# Altium schematic sheet control.SchDoc
size A4; SheetNumber: 1; SheetTotal: 2
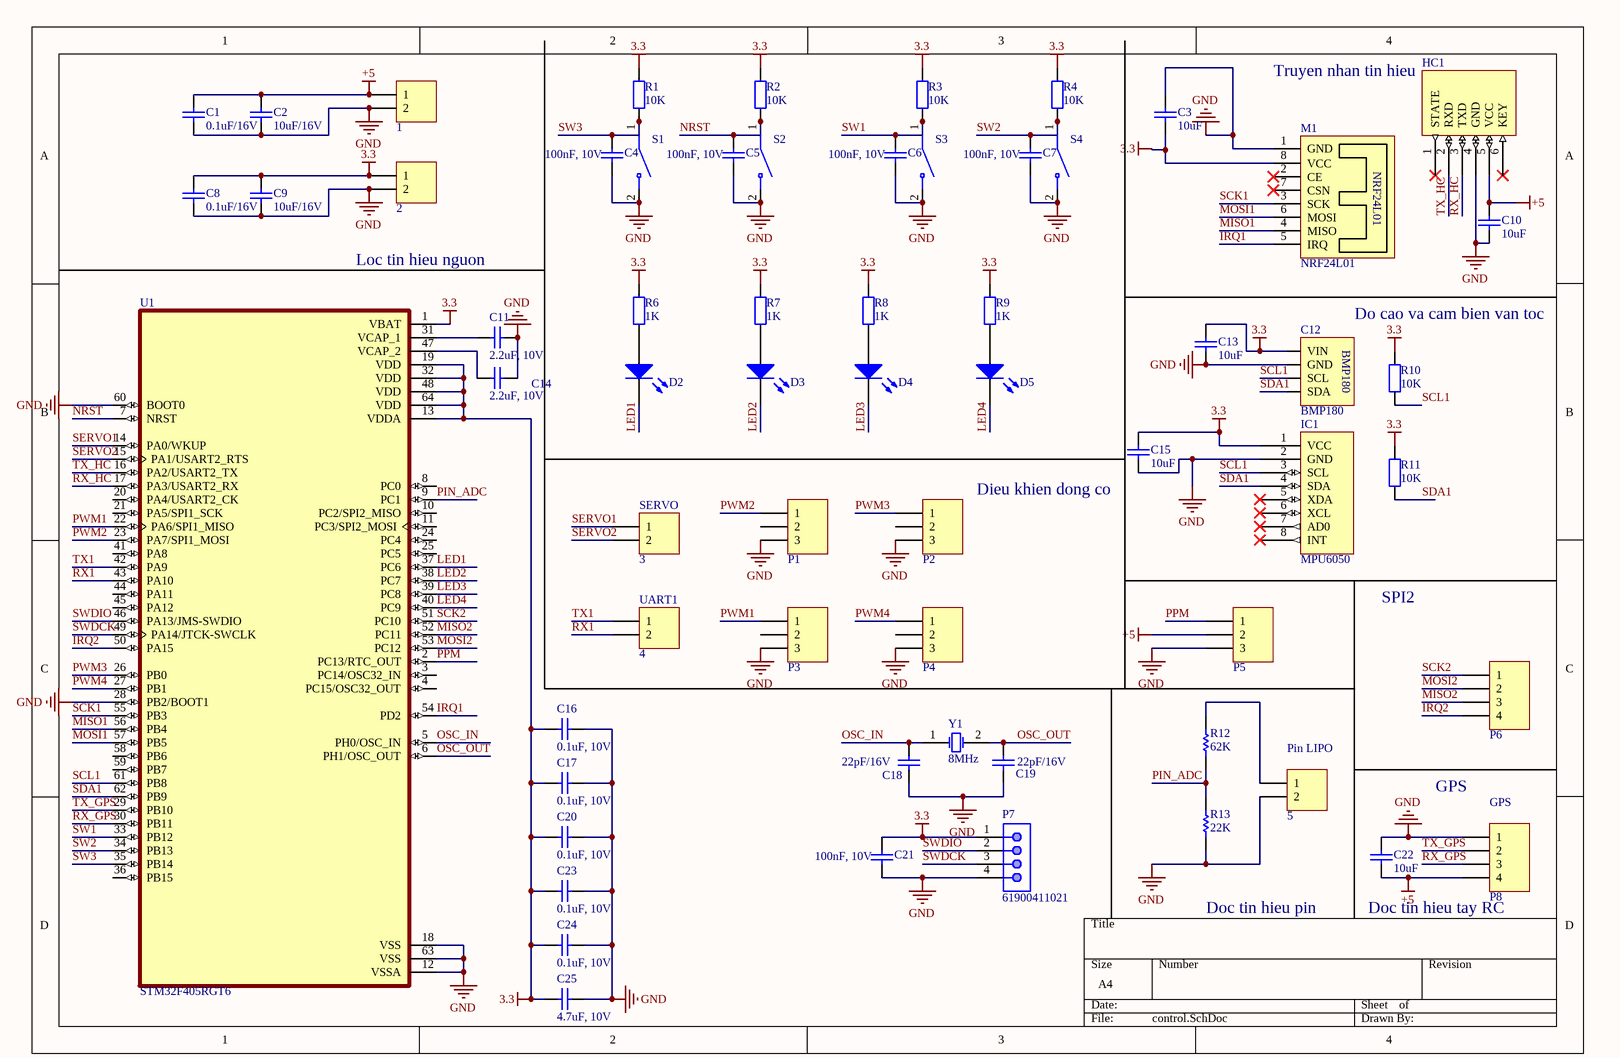
[diagram p0: control.SchDoc]

## Parts
1  Header 2  [JP2]  (value not drawn)
2  Header 2  [JP2]  (value not drawn)
3  Header 2  [JP2]  (value not drawn)
4  Header 2  [JP2]  (value not drawn)
5  Header 2  [JP2]  (value not drawn)
C1  0.1uF/16V  [WCAP-CSMH_0603_L1.6W0.8H0.8_Reflow]
C2  10uF/16V  [WCAP-CSMH_0603_L1.6W0.8H0.8_Reflow]
C3  10uF  [WCAP-CSGP_0603_H=0.8mm_Reflow]
C4  100nF, 10V  [WCAP-CSGP_0603_H=0.8mm_Reflow]
C5  100nF, 10V  [WCAP-CSGP_0603_H=0.8mm_Reflow]
C6  100nF, 10V  [WCAP-CSGP_0603_H=0.8mm_Reflow]
C7  100nF, 10V  [WCAP-CSGP_0603_H=0.8mm_Reflow]
C8  0.1uF/16V  [WCAP-CSMH_0603_L1.6W0.8H0.8_Reflow]
C9  10uF/16V  [WCAP-CSMH_0603_L1.6W0.8H0.8_Reflow]
C10  10uF  [WCAP-CSGP_0603_H=0.8mm_Reflow]
C11  2.2uF, 10V  [WCAP-CSGP_0603_H=0.8mm_Reflow]
C12  BMP180  [JP4-C1T]
C13  10uF  [WCAP-CSGP_0603_H=0.8mm_Reflow]
C14  2.2uF, 10V  [WCAP-CSGP_0603_H=0.8mm_Reflow]
C15  10uF  [WCAP-CSGP_0603_H=0.8mm_Reflow]
C16  0.1uF, 10V  [WCAP-CSGP_0603_H=0.8mm_Reflow]
C17  0.1uF, 10V  [WCAP-CSGP_0603_H=0.8mm_Reflow]
C18  22pF/16V  [WCAP-CSMH_0603_L1.6W0.8H0.8_Reflow]
C19  22pF/16V  [WCAP-CSMH_0603_L1.6W0.8H0.8_Reflow]
C20  0.1uF, 10V  [WCAP-CSGP_0603_H=0.8mm_Reflow]
C21  100nF, 10V  [WCAP-CSGP_0603_H=0.8mm_Reflow]
C22  10uF  [WCAP-CSGP_0603_H=0.8mm_Reflow]
C23  0.1uF, 10V  [WCAP-CSGP_0603_H=0.8mm_Reflow]
C24  0.1uF, 10V  [WCAP-CSGP_0603_H=0.8mm_Reflow]
C25  4.7uF, 10V  [WCAP-CSGP_0603_H=0.8mm_Reflow]
D2  LED SMD  [LED_0603_Blue]  (value not drawn)
D3  LED SMD  [LED_0603_Blue]  (value not drawn)
D4  LED SMD  [LED_0603_Blue]  (value not drawn)
D5  LED SMD  [LED_0603_Blue]  (value not drawn)
HC1  Module thu phát bluetooth HC-06  [hc-06]  (value not drawn)
IC1  MPU6050  [MPU6050]
M1  NRF24L01  [NRF24L01]
P1  Header 3  [JP3]  (value not drawn)
P2  Header 3  [JP3]  (value not drawn)
P3  Header 3  [JP3]  (value not drawn)
P4  Header 3  [JP3]  (value not drawn)
P5  Header 3  [JP3]  (value not drawn)
P6  Header 4  [JP4]  (value not drawn)
P7  61900411021  [61900411021]
P8  Header 4  [JP4]  (value not drawn)
R1  10K  [WRIS-KSKE_0603]
R2  10K  [WRIS-KSKE_0603]
R3  10K  [WRIS-KSKE_0603]
R4  10K  [WRIS-KSKE_0603]
R6  1K  [WRIS-KSKE_0603]
R7  1K  [WRIS-KSKE_0603]
R8  1K  [WRIS-KSKE_0603]
R9  1K  [WRIS-KSKE_0603]
R10  10K  [WRIS-KSKE_0603]
R11  10K  [WRIS-KSKE_0603]
R12  value 62K  [RES-SM-0805]  (hidden comment: RESISTOR SMD)
R13  value 22K  [RES-SM-0805]  (hidden comment: RESISTOR SMD)
S1  TS09-63-25-WT-160-SMT-TR  [SW_TS09-63-25-WT-160-SMT-TR]  (value not drawn)
S2  TS09-63-25-WT-160-SMT-TR  [SW_TS09-63-25-WT-160-SMT-TR]  (value not drawn)
S3  TS09-63-25-WT-160-SMT-TR  [SW_TS09-63-25-WT-160-SMT-TR]  (value not drawn)
S4  TS09-63-25-WT-160-SMT-TR  [SW_TS09-63-25-WT-160-SMT-TR]  (value not drawn)
U1  STM32F405RGT6  [QFP50P1200X1200X160-64N]
Y1  8MHz  [WE-XTAL_HC49/4H]

## Nets
3.3: 2.1 C3.2 C8.2 C9.2 C12.1(VIN) C13.1 C15.1 C16.2 C17.2 C20.2 C21.2 C23.2 C24.2 C25.2 IC1.1(VCC) M1.8(VCC) P7.1 R1.2 R2.2 R3.2 R4.2 R6.2 R7.2 R8.2 R9.2 R10.2 R11.2 U1.1(VBAT) U1.13(VDDA) U1.19(VDD) U1.32(VDD) U1.48(VDD) U1.64(VDD)
+5: 1.1 C1.2 C2.2 C10.1 C22.2 HC1.5(VCC) P5.2 P8.4
GND: 1.2 2.2 5.2 C1.1 C2.1 C3.1 C4.1 C5.1 C6.1 C7.1 C8.1 C9.1 C10.2 C11.2 C12.2(GND) C13.2 C14.2 C15.2 C16.1 C17.1 C18.1 C19.1 C20.1 C21.1 C22.1 C23.1 C24.1 C25.1 HC1.4(GND) IC1.2(GND) M1.1(GND) P1.3 P2.3 P3.3 P4.3 P5.3 P7.4 P8.1 R13.1 S1.2 S2.2 S3.2 S4.2 U1.12(VSSA) U1.18(VSS) U1.28(PB2/BOOT1) U1.60(BOOT0) U1.63(VSS)
IRQ1: M1.5(IRQ) U1.54(PD2)
IRQ2: P6.4 U1.50(PA15)
LED1: D2.2(K) U1.37(PC6)
LED2: D3.2(K) U1.38(PC7)
LED3: D4.2(K) U1.39(PC8)
LED4: D5.2(K) U1.40(PC9)
MISO1: M1.4(MISO) U1.56(PB4)
MISO2: P6.3 U1.52(PC11)
MOSI1: M1.6(MOSI) U1.57(PB5)
MOSI2: P6.2 U1.53(PC12)
NRST: C5.2 R2.1 S2.1 U1.7(NRST)
OSC_IN: C18.2 U1.5(PH0/OSC_IN) Y1.1(OSC1)
OSC_OUT: C19.2 U1.6(PH1/OSC_OUT) Y1.2(OSC2)
PIN_ADC: R12.1 R13.2 U1.9(PC1)
PPM: P5.1 U1.2(PC13/RTC_OUT)
PWM1: P3.1 U1.22(PA6/SPI1_MISO)
PWM2: P1.1 U1.23(PA7/SPI1_MOSI)
PWM3: P2.1 U1.26(PB0)
PWM4: P4.1 U1.27(PB1)
RX1: 4.2 U1.43(PA10)
RX_GPS: P8.3 U1.30(PB11)
RX_HC: HC1.3(TXD) U1.17(PA3/USART2_RX)
SCK1: M1.3(SCK) U1.55(PB3)
SCK2: P6.1 U1.51(PC10)
SCL1: C12.3(SCL) IC1.3(SCL) R10.1 U1.61(PB8)
SDA1: C12.4(SDA) IC1.4(SDA) R11.1 U1.62(PB9)
SERVO1: 3.1 U1.14(PA0/WKUP)
SERVO2: 3.2 U1.15(PA1/USART2_RTS)
SW1: C6.2 R3.1 S3.1 U1.33(PB12)
SW2: C7.2 R4.1 S4.1 U1.34(PB13)
SW3: C4.2 R1.1 S1.1 U1.35(PB14)
SWDCK: P7.3 U1.49(PA14/JTCK-SWCLK)
SWDIO: P7.2 U1.46(PA13/JMS-SWDIO)
TX1: 4.1 U1.42(PA9)
TX_GPS: P8.2 U1.29(PB10)
TX_HC: HC1.2(RXD) U1.16(PA2/USART2_TX)
Net5_1: 5.1 R12.2
NetC11_1: C11.1 U1.31(VCAP_1)
NetC14_1: C14.1 U1.47(VCAP_2)
NetD2_1: D2.1(A) R6.1
NetD3_1: D3.1(A) R7.1
NetD4_1: D4.1(A) R8.1
NetD5_1: D5.1(A) R9.1

Not connected (* = marked no-connect by the designer): HC1 1(STATE)* 6(KEY)*; IC1 5(XDA)* 6(XCL)* 7(AD0)* 8(INT)*; M1 2(CE)* 7(CSN)*; P1 2; P2 2; P3 2; P4 2; U1 3(PC14/OSC32_IN) 4(PC15/OSC32_OUT) 8(PC0) 10(PC2/SPI2_MISO) 11(PC3/SPI2_MOSI) 20(PA4/USART2_CK) 21(PA5/SPI1_SCK) 24(PC4) 25(PC5) 36(PB15) 41(PA8) 44(PA11) 45(PA12) 58(PB6) 59(PB7)

## Notes on the sheet
- Truyen nhan tin hieu
- Loc tin hieu nguon
- Do cao va cam bien van toc
- (near 3) SERVO
- (near C15) Dieu khien dong co
- (near 4) UART1
- SPI2
- (near 5) Pin LIPO
- GPS
- (near P8) GPS
- Doc tin hieu pin
- Doc tin hieu tay RC

## Library data of the parts
1-5 = Header 2: Header, 2-Pin; LatestRevisionDate: 17-Jul-2002; LatestRevisionNote: Re-released for DXP Platform.; Publisher: Altium Limited
C1 C2 C8 C9 C18 C19 = 885342006001: WCAP-CSMH Multilayer Ceramic Chip Capacitor, Mid and High Voltage, size 0603, NP0 Class I, 10pF, 250; Manufacturer: Wurth Elektronik; Case/Size Code: 0603; Capacitance Tolerance: 5%; Insulation Resistance: 10GΩ; Q Factor: 600; Rated Voltage (DC): 250V; Technical Reference: NP00603100J250DFCT10000; ComponentLink1Description: Website Link; ComponentLink1URL: https://www.we-online.com/redexpert/article/885342006001?ad; ComponentLink2Description: Datasheet Link; ComponentLink2URL: https://www.we-online.com/redexpert/spec/885342006001?ad; Manufacturer Part Number: 885342006001; Category: Multilayer Ceramic Chip Capacitors; Match Code: WCAP-CSMH; Mount: Surface Mount; Operating Temperature Max: 125°C; Operating Temperature Min: -55°C; Packaging: Tape and Reel; Length: 1.6mm; Width: 0.8mm; Height: 0.8mm; Capacitance: 10pF; Ceramic Type: NP0 Class I
C3-C7 C10 C11 C13-C17 C20-C25 = 885012006013: WCAP-CSGP Multilayer Ceramic Chip Capacitor, General Purpose, size 0603, NP0, 680pF, 10V; Manufacturer: Wurth Elektronik; Rated Voltage: 10VDC; Isolation Resistance: >=10GOhm; Capacitance Tolerance: +/-5%; Dissipation Factor: Q>=1000; Technical Reference: NP00603681J010DFCT10000; ComponentLink1Description: Manufacturer; ComponentLink1URL: http://www.we-online.de; ComponentLink2Description: Datasheet; ComponentLink2URL: https://www.we-online.com/catalog/datasheet/885012006013.pdf; Operating Temperature: -55 to +125degC; Packaging: Tape and Reel; Manufacturer Part Number: 885012006013; Published Date: May 2020; Ceramic Type: NP0; Height: 0.8mm; Mounting Technology: SMT; Size: 0603; Capacitance: 680pF
C12 = BMP180: Manufacturer: W¨¹rth Elektronik eiSos GmbH; partNo: 613004143121; ComponentLink1 Description: Manufacturer; ComponentLink2 Description: Datasheet; NoPins: 04; Created Date: 29 March 2013; ComponentLink1URL: http://www.we-online.com; ComponentLink2URL: http://katalog.we-online.de/em/datasheet/6130xx143121.pdf; Created by: Karrer Zheng
D2-D5 = LED SMD: LED
HC1 = HC-06: CSR Bluetooth V2.0; WEB: TECHMT.VN
IC1 = IMU MPU6050: GY-521 6DOF IMU MPU6050 / TECHMT.VN; WEB: TECHMT.VN
P1-P5 = Header 3: Header, 3-Pin; LatestRevisionDate: 17-Jul-2002; LatestRevisionNote: Re-released for DXP Platform.; Publisher: Altium Limited
P6 P8 = Header 4: Header, 4-Pin; LatestRevisionDate: 17-Jul-2002; LatestRevisionNote: Re-released for DXP Platform.; Publisher: Altium Limited
P7 = 61900411021: WR-WTB THT Male Left Angled Bottom Locking Header, pitch 2.54mm, 4p; Pin Number: 4; Contact Resistance: 20mOhm; Rated Current: 3A; Withstanding Voltage: 1000VAC; Working Voltage: 250VAC; ComponentLink1Description: Manufacturer; ComponentLink1URL: http://www.we-online.de; ComponentLink2Description: Datasheet; ComponentLink2URL: https://www.we-online.com/catalog/datasheet/61900411021.pdf; Pitch: 2.54mm; Published Date: January 2020; Publisher: Wurth Elektronik; Mounting Technology: THT; Packaging: Bag; Operating Temperature: -40 to +105degC; Part Number: 61900411021; Gender: Male; Type: Right Angled Bottom Locking
R1-R4 R6-R11 = 560050316012: WRIS-KSKE SMT Thick Film Resistor, size 0603, 10Ohm, 0.25W; Manufacturer: Wurth Elektronik; Rated Current: 0.15A; Temperature Coefficient of Resistance: +/-100ppm/degC; Technical Reference: KE06030100F104KAATP0000; Resistance Tolerance: +/-1%; ComponentLink1Description: Manufacturer; ComponentLink1URL: http://www.we-online.de; ComponentLink2Description: Datasheet; ComponentLink2URL: https://www.we-online.com/catalog/datasheet/560050316012.pdf; Published Date: May 2020; Rated Power: 0.25W; Resistance: 10Ohm; Height: 0.45mm; Operating Temperature: -55 to +155degC; Mounting Technology: SMT; Packaging: Tape and Reel; Size: 0603; Length: 1.6mm; Manufacturer Part Number: 560050316012; Width: 0.8mm
R12 R13 = RESISTOR SMD: Resistor
U1 = STM32F405RGT6: High-performance foundation line, ARM Cortex-M4 core with DSP and FPU, 1 Mbyte Flash, 168 MHz CPU, ART Accelerator; MP: STM32F405RGT6; Value: *; Price: None; Package: None; Availability: Unavailable
Y1 = 830003156B: WE-XTAL Quartz Crystal, THT, HC49/4H, 8MHz, +/-30ppm; Manufacturer: Wurth Elektronik; Frequency Stability: +/-50ppm; Load Capacitance: 30pF; ComponentLink1Description: Manufacturer; ComponentLink1URL: http://www.we-online.de; ComponentLink2Description: Datasheet; ComponentLink2URL: https://katalog.we-online.com/pbs/datasheet/830003156B.pdf; Operating Temperature: -20 to +70degC; Packaging: Bulk; Manufacturer Part Number: 830003156B; Published Date: July 2020; Size: HC49/4H; Frequency: 8MHz; Frequency Tolerance: +/-30ppm; Mounting Technology: THT
S1-S4 = TS09-63-25-WT-160-SMT-TR: Price: None; Availability: Unavailable; Package: None; Value: *; MP: TS09-63-25-WT-160-SMT-TR